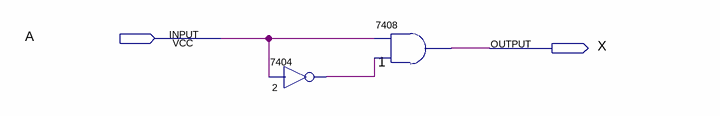
[diagram p0: schematic sheet]
// Quartus schematic Project.bdf as structural Verilog: 2 symbols, 2 pins
module Project (
  input  A,
  output X
);

  wire n2_1;

  \7404  u_2 (.\2 (A), .\1 (n2_1));
  \7408  u_1 (.\3 (n2_1), .\2 (A), .\1 (X));
endmodule
